# EasyEDA Pro project 室内环境监测器.eprj

# Schematic Schematic1
Create Date: 2023-04-25; Page Name: P1; Project Name: 室内环境监测器; Schematic Name: Schematic1; Update Date: 2023-04-25
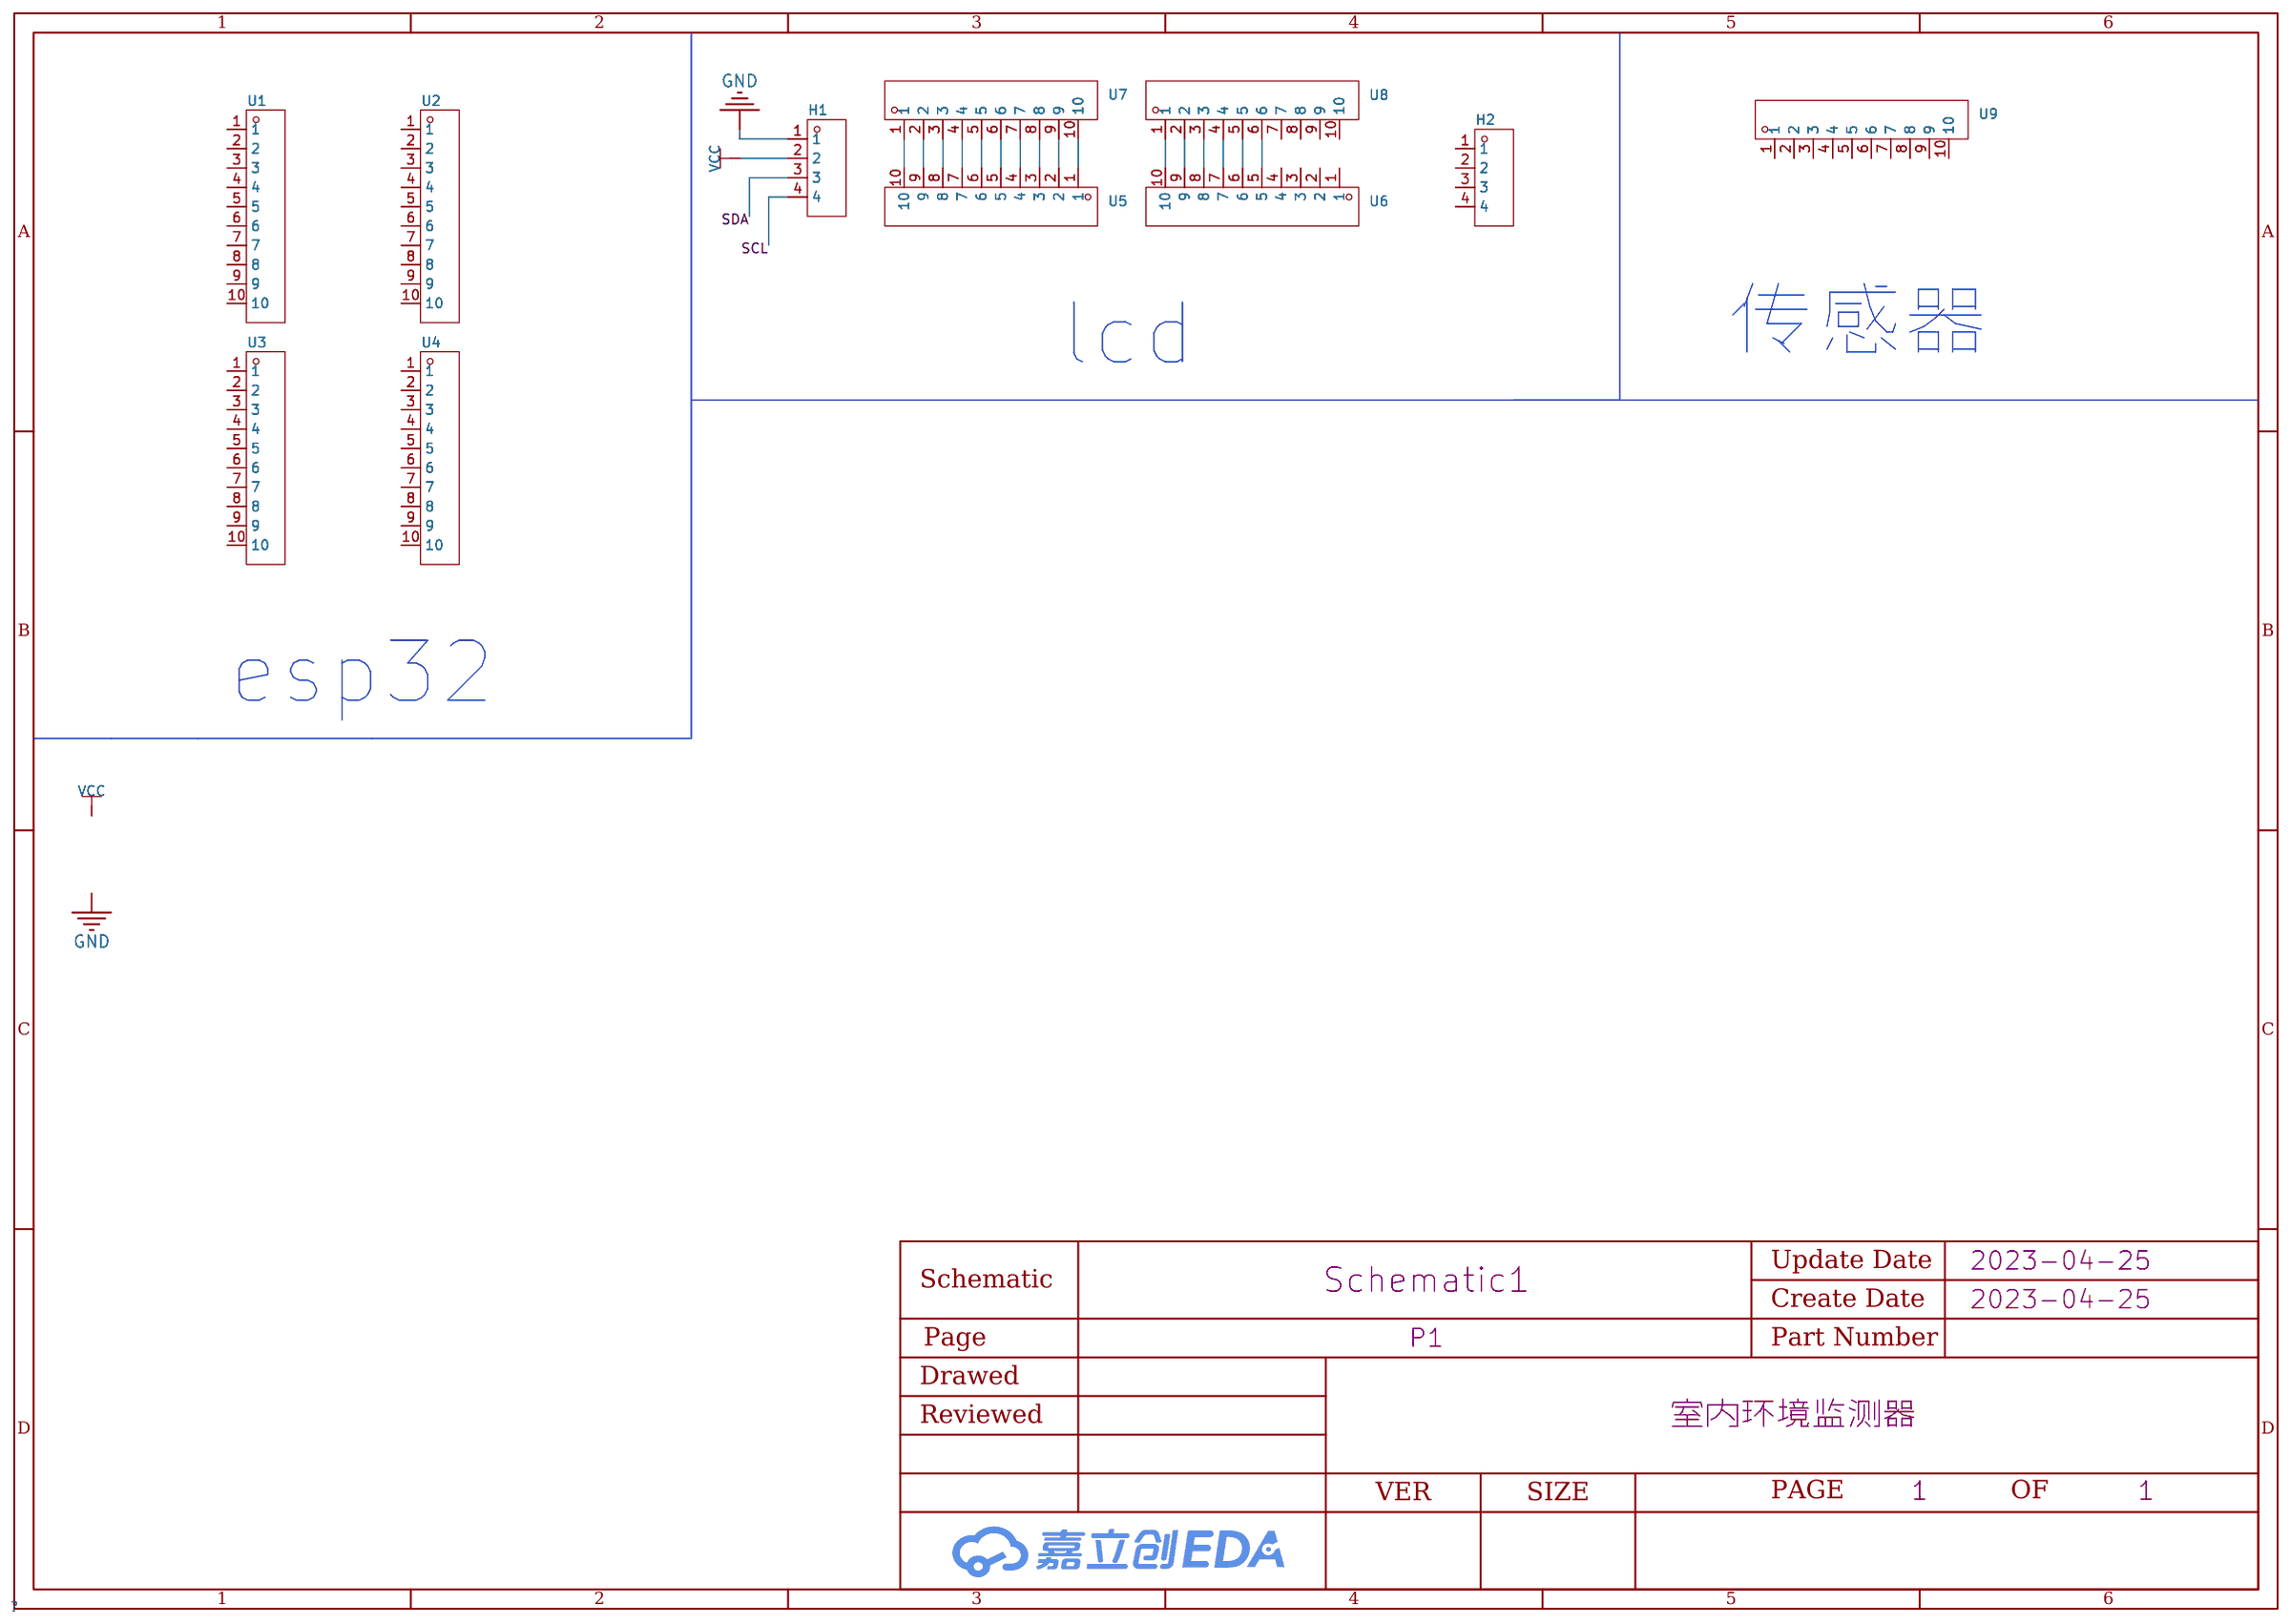
[diagram p0: schematic sheet]

## Parts
H1  826629-4  [HDR-TH_4P-P2.54-V-M-1]
H2  826629-4  [HDR-TH_4P-P2.54-V-M-1]
U1  间距2.54mm蓝色排母座1x10pin  [HDR-TH_10P-P2.54-V-F-2]
U2  间距2.54mm蓝色排母座1x10pin  [HDR-TH_10P-P2.54-V-F-2]
U3  间距2.54mm蓝色排母座1x10pin  [HDR-TH_10P-P2.54-V-F-2]
U4  间距2.54mm蓝色排母座1x10pin  [HDR-TH_10P-P2.54-V-F-2]
U5  间距2.54mm蓝色排母座1x10pin  [HDR-TH_10P-P2.54-V-F-2]
U6  间距2.54mm蓝色排母座1x10pin  [HDR-TH_10P-P2.54-V-F-2]
U7  间距2.54mm蓝色排母座1x10pin  [HDR-TH_10P-P2.54-V-F-2]
U8  间距2.54mm蓝色排母座1x10pin  [HDR-TH_10P-P2.54-V-F-2]
U9  间距2.54mm蓝色排母座1x10pin  [HDR-TH_10P-P2.54-V-F-2]

## Library data of the parts
H1 H2 = 826629-4: 排数:单排;总PIN位数:4;间距:2.54mm;插针结构:1x4P;行距:-;安装类型:直插;圆针/方针:-;额定电流:-;额定电压:-;配合针长度:6.7mm;塑高:2.8mm;端接针长度:3.2mm;触头材质:-;工作温度范围:-;颜色:绿色;; LCSC Part Name: 2.54mm 1x4P 直插; Supplier Part: C590277; Manufacturer: TE Connectivity(美国泰科); Supplier Footprint: 插件,P=2.54mm; JLCPCB Part Class: Extended Part; Datasheet: https://atta.szlcsc.com/upload/public/pdf/source/20210923/FCC8CD9A04BA2624CF68C067B4A5B53A.pdf; Supplier: LCSC; Number of Rows: 单排; Number of Pins: 4; Pitch: 2.54mm; Pin Structure: 1x4P; Mounting Type: 直插; Length of Mating Pin: 6.7mm; Insulation Height: 2.8mm; Length of End Connection Pin: 3.2mm; Color: 绿色
U1-U9 = 间距2.54mm蓝色排母座1x10pin: Supplier Part: C9900015505; Supplier Footprint: 间距2.54MM单排母座蓝色(1*10P）; JLCPCB Part Class: Extended Part; Datasheet: https://atta.szlcsc.comnull; Supplier: LCSC

## Nets
GND: H1.1
VCC: H1.2
SCL: H1.4
SDA: H1.3
Net-(U5-1): U5.1 U7.10
Net-(U5-2): U5.2 U7.9
Net-(U5-3): U5.3 U7.8
Net-(U5-4): U5.4 U7.7
Net-(U5-5): U5.5 U7.6
Net-(U5-6): U5.6 U7.5
Net-(U5-7): U5.7 U7.4
Net-(U5-8): U5.8 U7.3
Net-(U5-9): U5.9 U7.2
Net-(U5-10): U5.10 U7.1
Net-(U6-5): U6.5 U8.6
Net-(U6-6): U6.6 U8.5
Net-(U6-7): U6.7 U8.4
Net-(U6-8): U6.8 U8.3
Net-(U6-9): U6.9 U8.2
Net-(U6-10): U6.10 U8.1

Not connected (* = marked no-connect by the designer): H2 1 2 3 4; U1 1 2 3 4 5 6 7 8 9 10; U2 1 2 3 4 5 6 7 8 9 10; U3 1 2 3 4 5 6 7 8 9 10; U4 1 2 3 4 5 6 7 8 9 10; U6 1 2 3 4; U8 7 8 9 10; U9 1 2 3 4 5 6 7 8 9 10

## Notes on the sheet
- 传感器
- lcd
- esp32

# Schematic 16p单排母座_2023-04-25
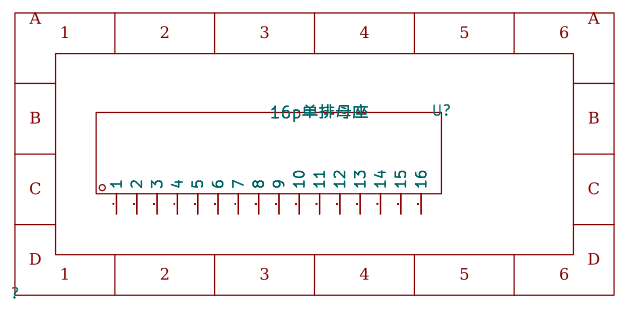
[diagram p1: schematic sheet]

## Parts
U?#1  16p单排母座

## Library data of the parts
U?#1 = undefined: Origin Footprint 2: 16P单排母座

## Nets

Not connected (* = marked no-connect by the designer): U?#1 1 2 3 4 5 6 7 8 9 10 11 12 13 14 15 16

# Board PCB1
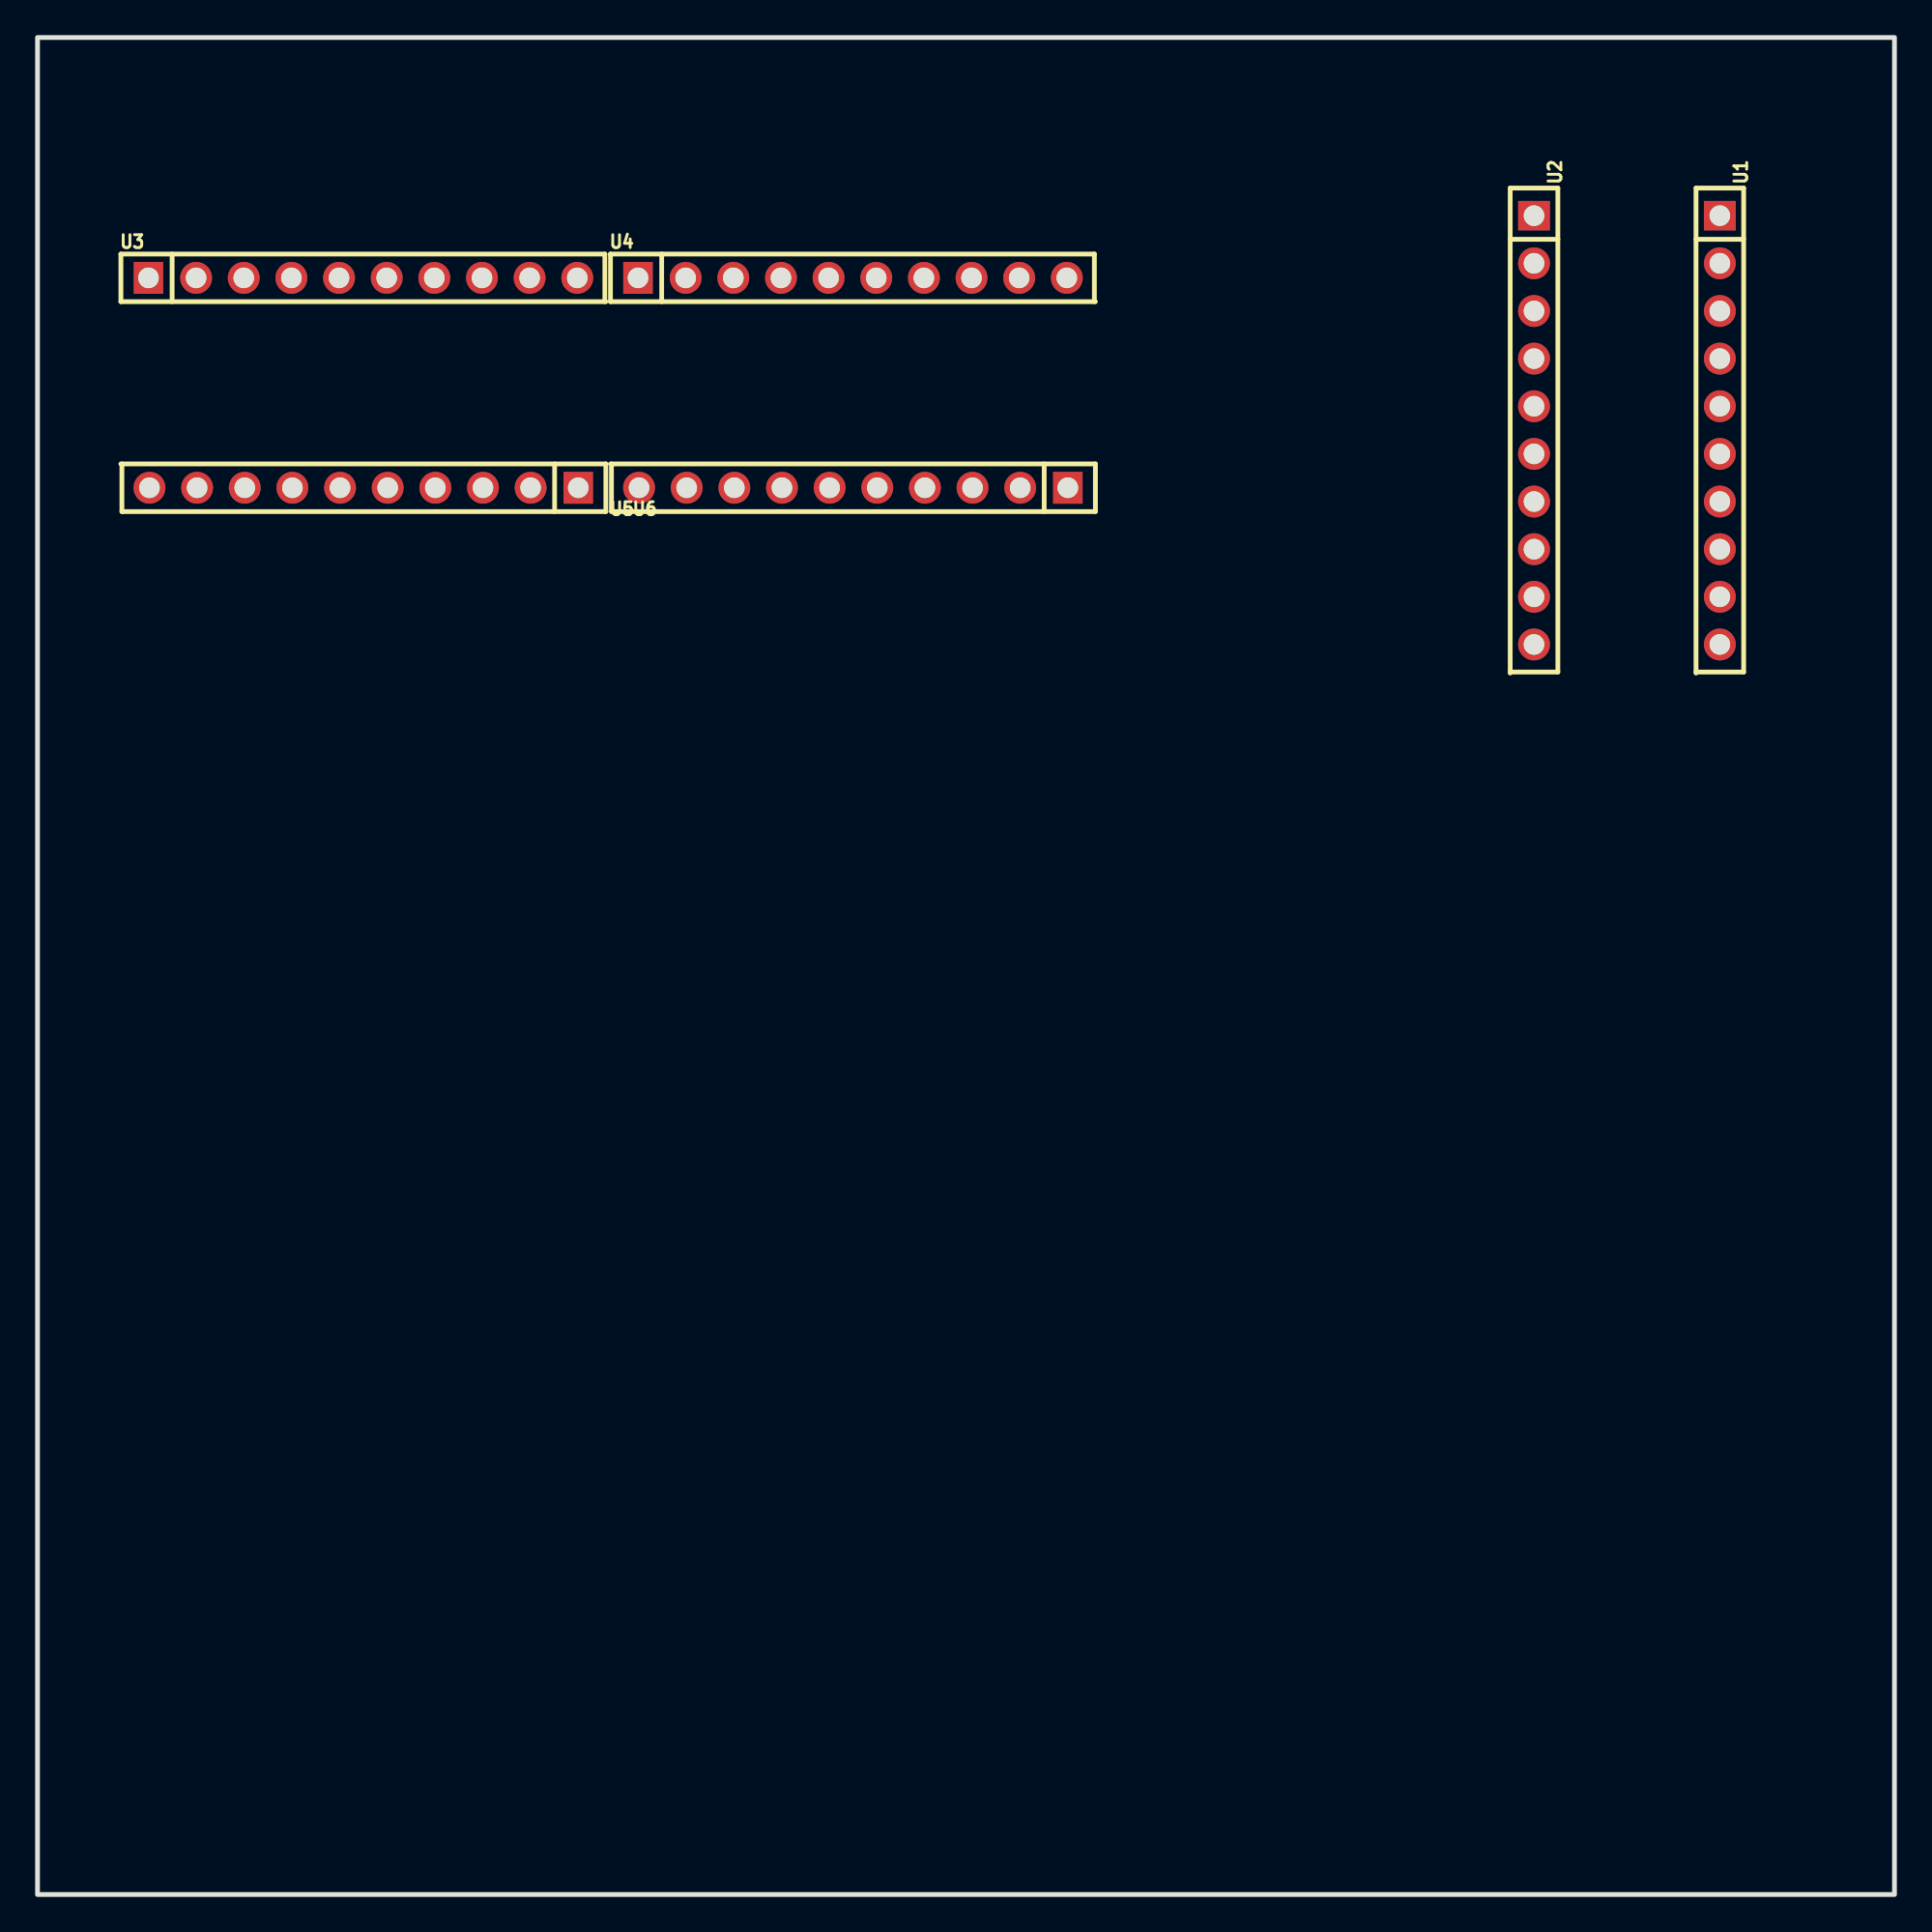
[diagram p2: board, top side]
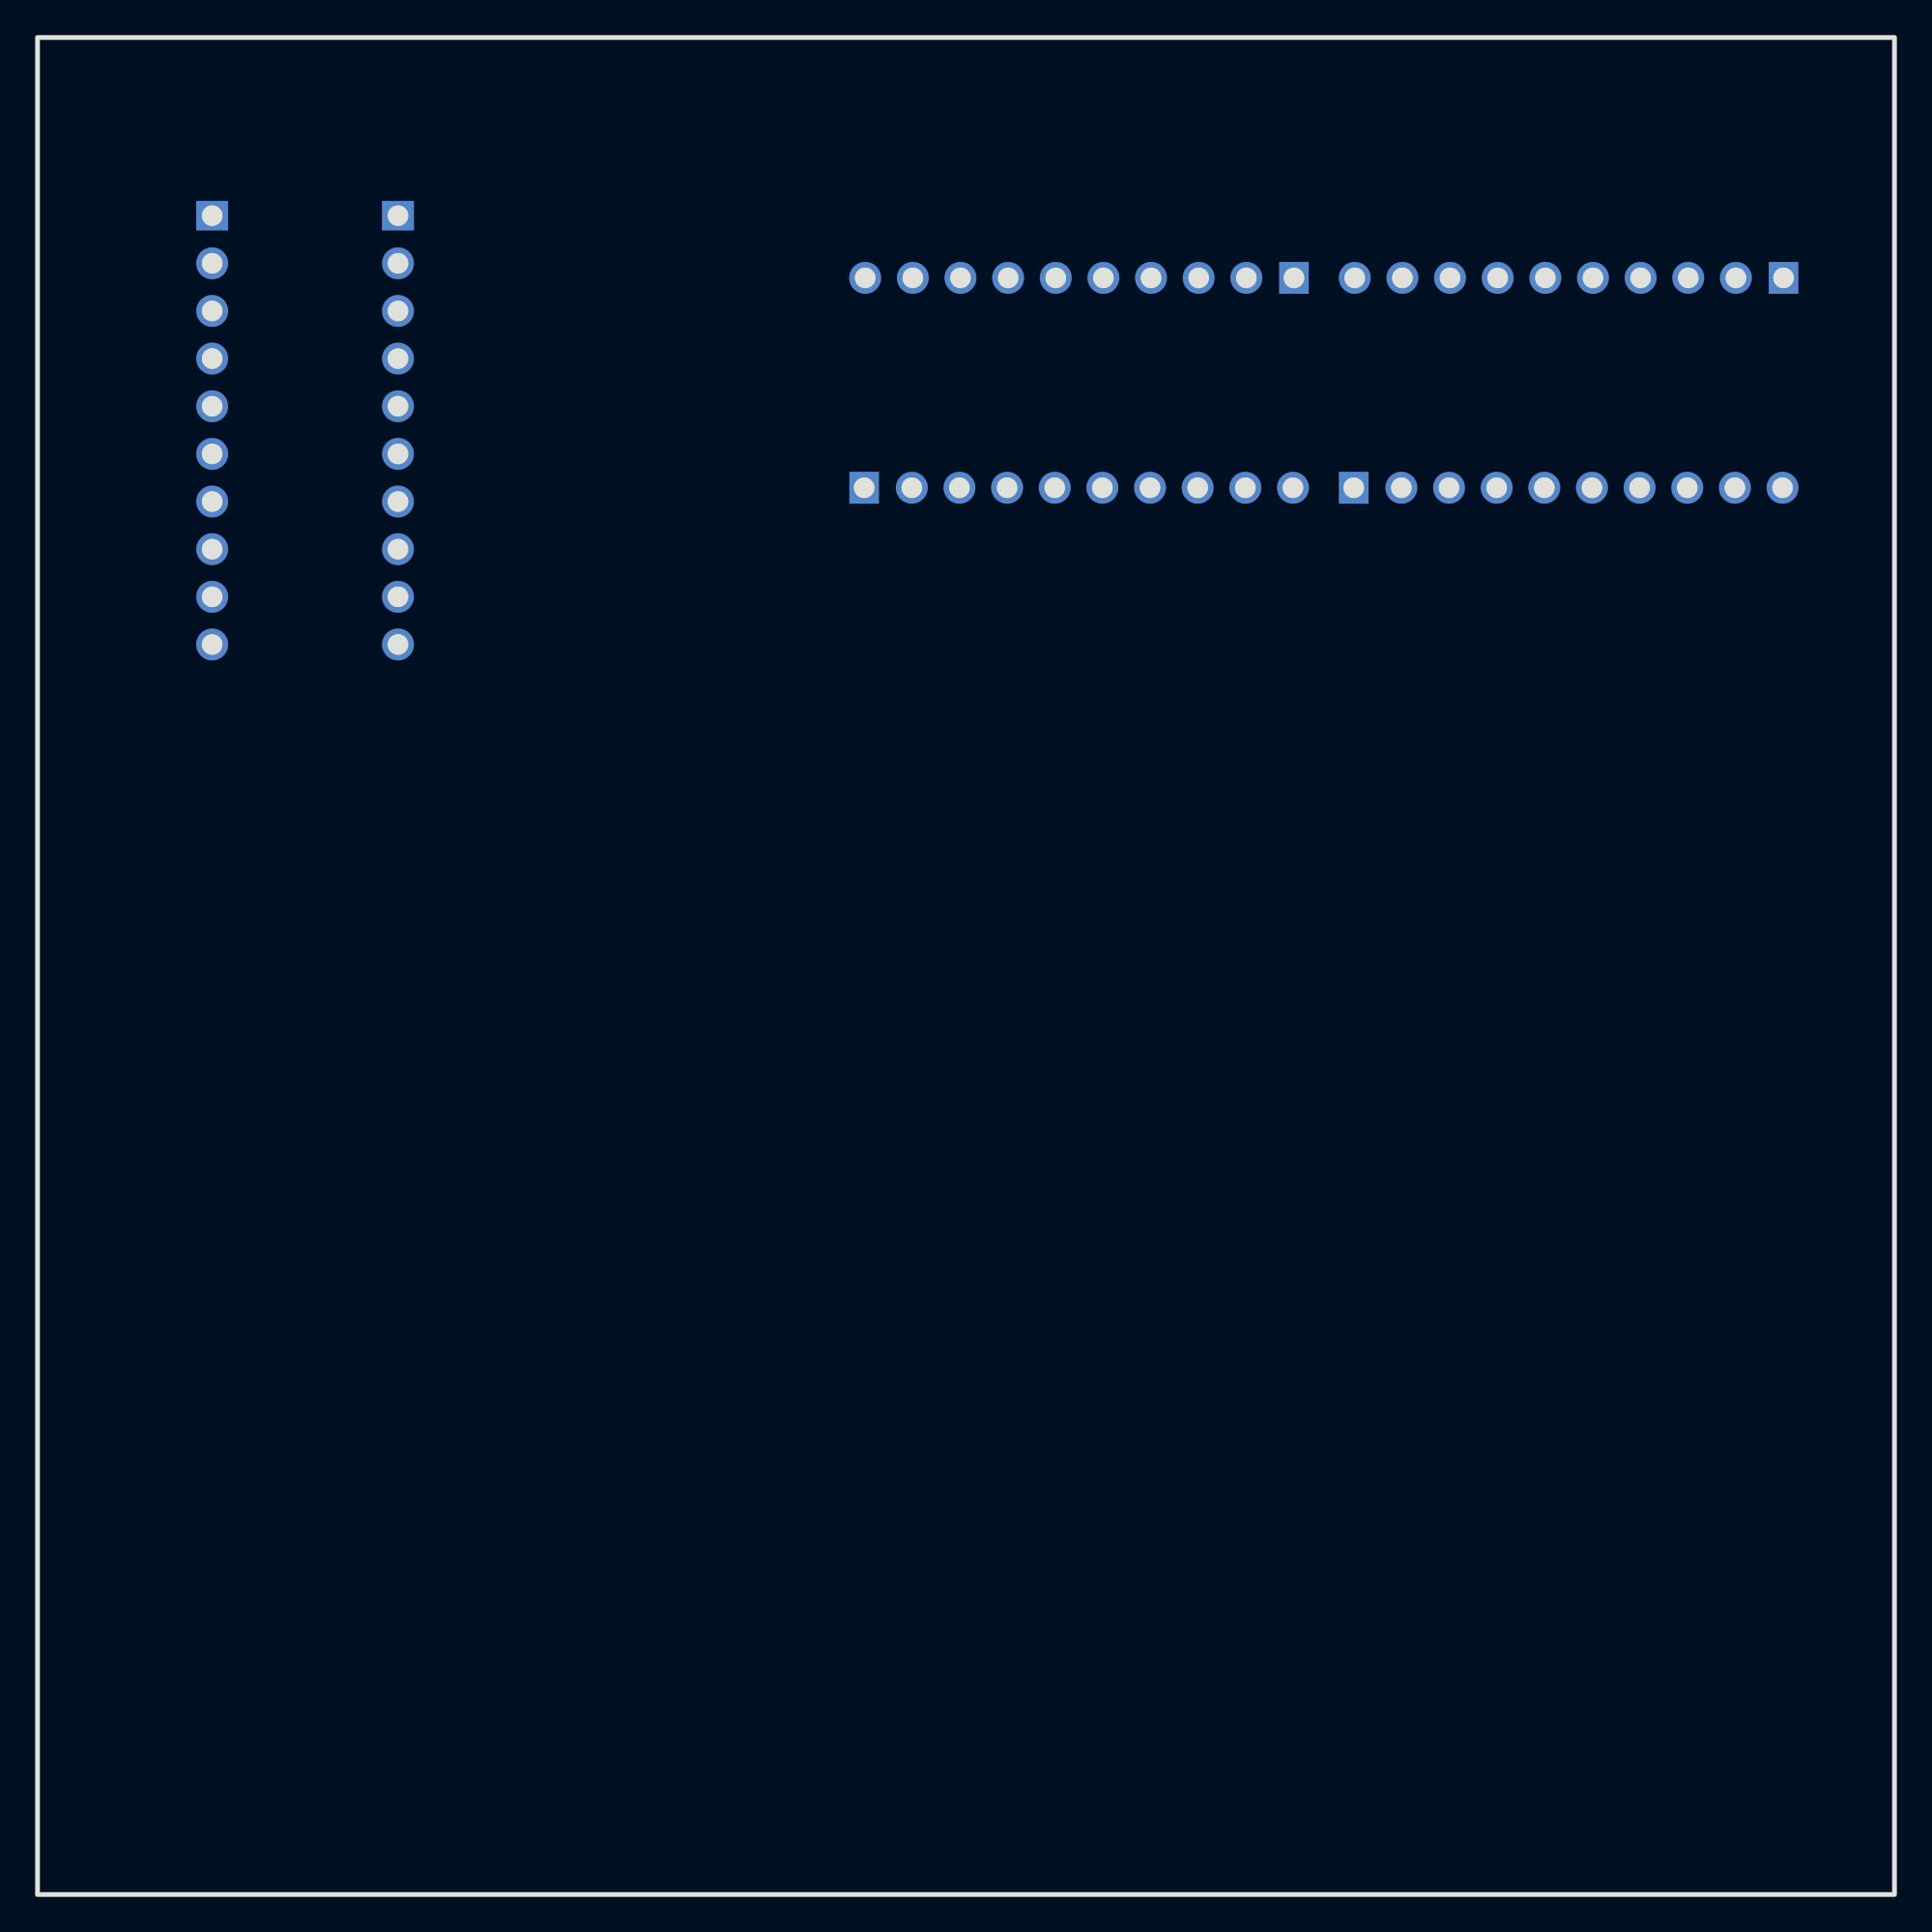
[diagram p3: board, bottom side, seen from below]

Outline 99 x 99 mm; copper layers: Top Layer, Bottom Layer. Coordinates in mm from the lower left corner of the outline.
Outline path: rectangle 0,99 99,0
Stack: Top Layer 0.035mm / Dielectric1 1.51mm FR4 er 4.5 / Bottom Layer 0.035mm

## Design rules (mm)
spacing safeClearance (default): track to track 0.152, other pairs 0.152 to 0.3
track width trackWidth (default): min 0.127, default 0.254, max 2.54
differential pair differentialPair (default): width min 0.127, default 0.254, max 2.54; gap min 0.152, default 0.152
via viaSize (default): diameter min 0.5, default 0.61, max 10; hole min 0.3, default 0.305, max 6

## Placement (name value [footprint] x y rotation side)
U1  间距2.54mm蓝色排母座1x10pin  [HDR-TH_10P-P2.54-V-F-2]  89.69 78.07 270 top
U2  间距2.54mm蓝色排母座1x10pin  [HDR-TH_10P-P2.54-V-F-2]  79.78 78.07 270 top
U3  间距2.54mm蓝色排母座1x10pin  [HDR-TH_10P-P2.54-V-F-2]  17.34 86.19 0 top
U4  间距2.54mm蓝色排母座1x10pin  [HDR-TH_10P-P2.54-V-F-2]  43.44 86.19 0 top
U5  间距2.54mm蓝色排母座1x10pin  [HDR-TH_10P-P2.54-V-F-2]  17.4 75 180 top
U6  间距2.54mm蓝色排母座1x10pin  [HDR-TH_10P-P2.54-V-F-2]  43.5 75 180 top

## Footprints (pads in the part's own frame, mm; a bottom-side part is the same pattern mirrored in y, then rotated)
HDR-TH_10P-P2.54-V-F-2
  rect 1.575x1.7 hole 1.1: 1(-11.43,0)
  round 1.7 hole 1.1: 2(-8.89,0) 3(-6.35,0) 4(-3.81,0) 5(-1.27,0) 6(1.27,0) 7(3.81,0) 8(6.35,0) 9(8.89,0) 10(11.43,0)

## Nets
$1N2016: U3.4 U5.7
$1N2031: U3.7 U5.4
$1N2394: U3.1 U5.10
$1N2397: U3.2 U5.9
$1N2400: U3.3 U5.8
$1N2406: U3.5 U5.6
$1N2409: U3.6 U5.5
$1N2415: U3.8 U5.3
$1N2418: U3.9 U5.2
$1N2421: U3.10 U5.1
$1N2425: U4.1 U6.10
$1N2428: U4.2 U6.9
$1N2431: U4.3 U6.8
$1N2434: U4.4 U6.7
$1N2437: U4.5 U6.6
$1N2440: U4.6 U6.5

Pads without a net: U1 1 2 3 4 5 6 7 8 9 10; U2 1 2 3 4 5 6 7 8 9 10; U4 7 8 9 10; U6 1 2 3 4
